# Altium project PowerManagement.PrjPcb
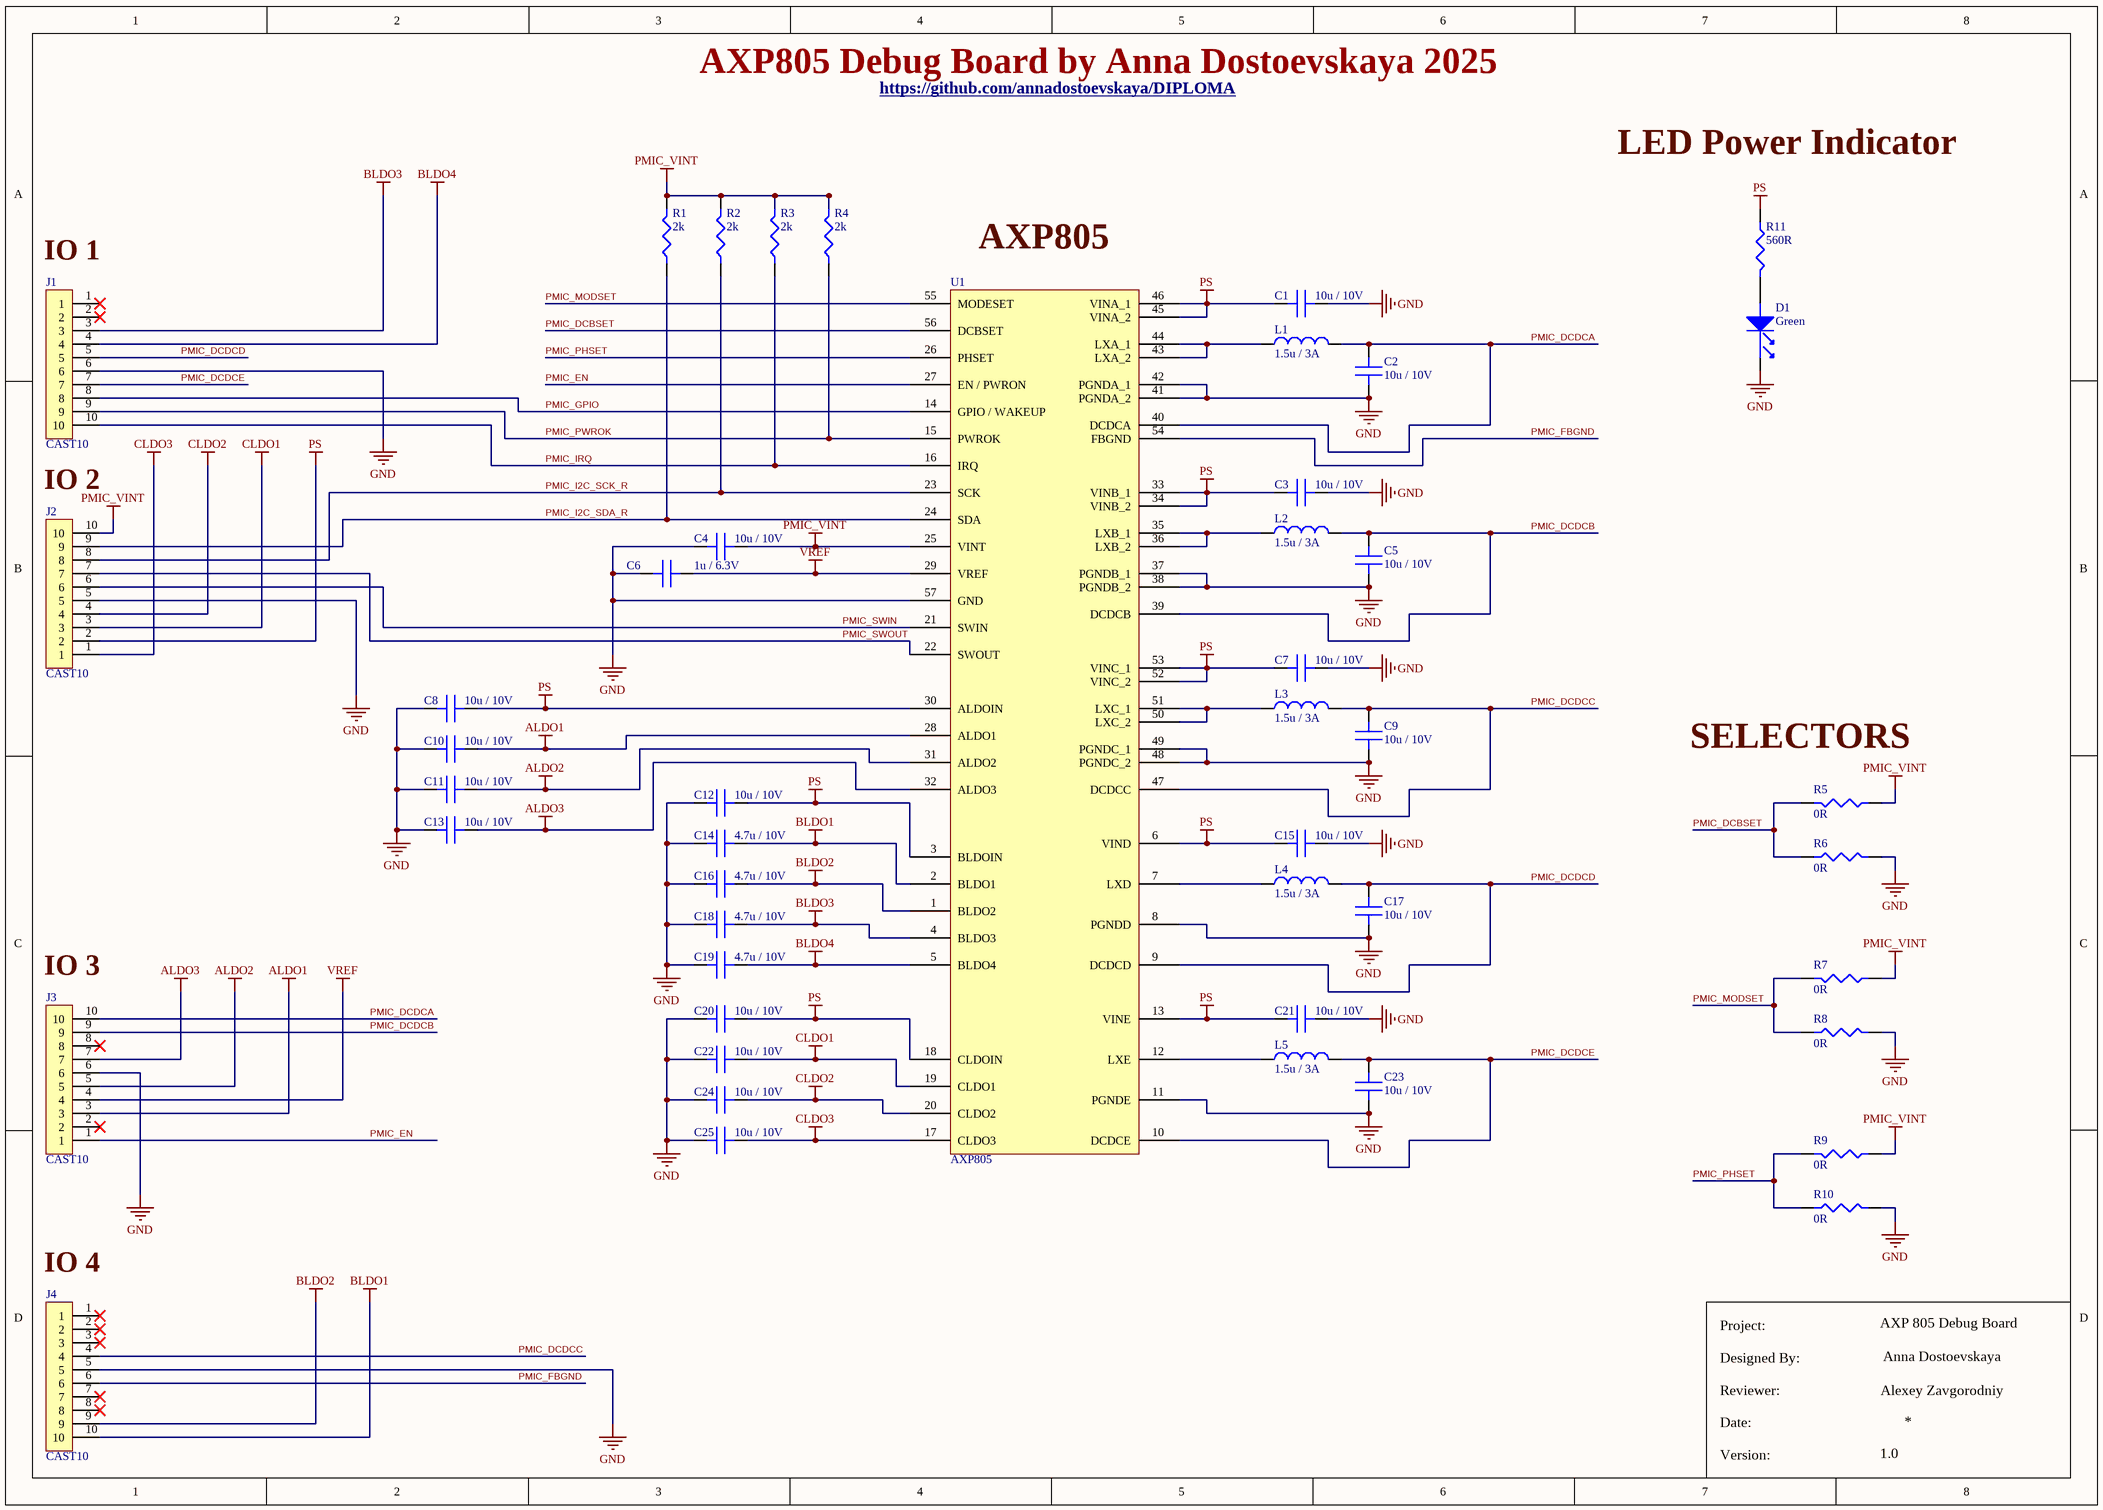
[diagram p0: PowerManagement.SchDoc]
DesignedBy: Anna Dostoevskaya; NotFitted: NF; ProjectTitle: AXP 805 Debug Board; Reviewer: Alexey Zavgorodniy; VersionRevision: 1.0
1 sheet, 47 parts. Net scope: global (net labels, ports and power ports of the same name join across sheets).
Board file: PowerManagement.PcbDoc

## Sheet PowerManagement.SchDoc
size A3; SheetNumber: 1; SheetTotal: 1

### Parts
C1  10u / 10V  [C0603]
C2  10u / 10V  [C0603]
C3  10u / 10V  [C0603]
C4  10u / 10V  [C0603]
C5  10u / 10V  [C0603]
C6  1u / 6.3V  [C0402]
C7  10u / 10V  [C0603]
C8  10u / 10V  [C0603]
C9  10u / 10V  [C0603]
C10  10u / 10V  [C0603]
C11  10u / 10V  [C0603]
C12  10u / 10V  [C0603]
C13  10u / 10V  [C0603]
C14  4.7u / 10V  [C0603]
C15  10u / 10V  [C0603]
C16  4.7u / 10V  [C0603]
C17  10u / 10V  [C0603]
C18  4.7u / 10V  [C0603]
C19  4.7u / 10V  [C0603]
C20  10u / 10V  [C0603]
C21  10u / 10V  [C0603]
C22  10u / 10V  [C0603]
C23  10u / 10V  [C0603]
C24  10u / 10V  [C0603]
C25  10u / 10V  [C0603]
D1  Green  [LED_0603]
J1  CAST10  [CAST10_2.54MM]  (no BOM)
J2  CAST10  [CAST10_2.54MM]  (no BOM)
J3  CAST10  [CAST10_2.54MM]  (no BOM)
J4  CAST10  [CAST10_2.54MM]  (no BOM)
L1  1.5u / 3A  [SPM3015]
L2  1.5u / 3A  [SPM3015]
L3  1.5u / 3A  [SPM3015]
L4  1.5u / 3A  [SPM3015]
L5  1.5u / 3A  [SPM3015]
R1  2k  [R0402]
R2  2k  [R0402]
R3  2k  [R0402]
R4  2k  [R0402]
R5  0R  [R0402]
R6  0R  [R0402]
R7  0R  [R0402]
R8  0R  [R0402]
R9  0R  [R0402]
R10  0R  [R0402]
R11  560R  [R0402]
U1  AXP805  [QFN7x7MM]

### Nets
ALDO1: C10.2 J3.3 U1.28(ALDO1)
ALDO2: C11.2 J3.5 U1.31(ALDO2)
ALDO3: C13.2 J3.7 U1.32(ALDO3)
BLDO1: C14.2 J4.10 U1.2(BLDO1)
BLDO2: C16.2 J4.9 U1.1(BLDO2)
BLDO3: C18.2 J1.3 U1.4(BLDO3)
BLDO4: C19.2 J1.4 U1.5(BLDO4)
CLDO1: C22.2 J2.3 U1.19(CLDO1)
CLDO2: C24.2 J2.4 U1.20(CLDO2)
CLDO3: C25.2 J2.1 U1.17(CLDO3)
GND: C1.2 C2.1 C3.2 C4.1 C5.1 C6.1 C7.2 C8.1 C9.1 C10.1 C11.1 C12.1 C13.1 C14.1 C15.2 C16.1 C17.1 C18.1 C19.1 C20.1 C21.2 C22.1 C23.1 C24.1 C25.1 D1.1(Cathode) J1.6 J2.5 J3.6 J4.5 R6.2 R8.2 R10.2 U1.8(PGNDD) U1.11(PGNDE) U1.37(PGNDB_1) U1.38(PGNDB_2) U1.41(PGNDA_2) U1.42(PGNDA_1) U1.48(PGNDC_2) U1.49(PGNDC_1) U1.57(GND)
PMIC_VINT: C4.2 J2.10 R1.2 R2.2 R3.2 R4.2 R5.1 R7.1 R9.1 U1.25(VINT)
PS: C1.1 C3.1 C7.1 C8.2 C12.2 C15.1 C20.2 C21.1 J2.2 R11.1 U1.3(BLDOIN) U1.6(VIND) U1.13(VINE) U1.18(CLDOIN) U1.30(ALDOIN) U1.33(VINB_1) U1.34(VINB_2) U1.45(VINA_2) U1.46(VINA_1) U1.52(VINC_2) U1.53(VINC_1)
VREF: C6.2 J3.4 U1.29(VREF)
PMIC_DCBSET: R5.2 R6.1 U1.56(DCBSET)
PMIC_DCDCA: C2.2 J3.10 L1.2 U1.40(DCDCA)
PMIC_DCDCB: C5.2 J3.9 L2.2 U1.39(DCDCB)
PMIC_DCDCC: C9.2 J4.4 L3.2 U1.47(DCDCC)
PMIC_DCDCD: C17.2 J1.5 L4.2 U1.9(DCDCD)
PMIC_DCDCE: C23.2 J1.7 L5.2 U1.10(DCDCE)
PMIC_EN: J3.1 U1.27(EN_/_PWRON)
PMIC_FBGND: J4.6 U1.54(FBGND)
PMIC_GPIO: J1.8 U1.14(GPIO_/_WAKEUP)
PMIC_I2C_SCK_R: J2.8 R2.1 U1.23(SCK)
PMIC_I2C_SDA_R: J2.9 R1.1 U1.24(SDA)
PMIC_IRQ: J1.10 R3.1 U1.16(IRQ)
PMIC_MODSET: R7.2 R8.1 U1.55(MODESET)
PMIC_PHSET: R9.2 R10.1 U1.26(PHSET)
PMIC_PWROK: J1.9 R4.1 U1.15(PWROK)
PMIC_SWIN: J2.6 U1.21(SWIN)
PMIC_SWOUT: J2.7 U1.22(SWOUT)
NetD1_2: D1.2(Anode) R11.2
NetL1_1: L1.1 U1.43(LXA_2) U1.44(LXA_1)
NetL2_1: L2.1 U1.35(LXB_1) U1.36(LXB_2)
NetL3_1: L3.1 U1.50(LXC_2) U1.51(LXC_1)
NetL4_1: L4.1 U1.7(LXD)
NetL5_1: L5.1 U1.12(LXE)

Not connected (* = marked no-connect by the designer): J1 1* 2*; J3 2* 8*; J4 1* 2* 3* 7* 8*

### Notes on the sheet
- https://github.com/annadostoevskaya/DIPLOMA
- AXP805 Debug Board by Anna Dostoevskaya 2025
- LED Power Indicator
- (near J1) IO 1
- (near U1) AXP805
- IO 2
- (near R5) SELECTORS
- (near J3) IO 3
- (near J4) IO 4
- Project:
  Designed By:
  Reviewer:
  Date:
  Version:

### Library data of the parts
C1-C5 C7-C13 C15 C17 C20-C25 = C1608X5R1A106K080AC: C Series 0603 10 uF 10 V ±10 % Tolerance X5R SMT Multilayer Ceramic Capacitor; Manufacturer: TDK; Material: 4241ConductorMaterial; Capacitance: 10uF; Tolerance: 10%; Supplier 1: Digikey; Manufacturer Part Number: C1608X5R1A106K080AC; RoHS: Yes; Category: Ceramic Capacitors; Stock 1: 79274; Pricing 1: 1=0.25, 10=0.145, 100=0.0918, 1000=0.06453 (USD); Mount: Surface Mount; Case/Package: 0603; Number of Pins: 2NUMBER; Case Code (Imperial): 0603; Case Code (Metric): 1608; Weight: 7.1E-05oz; Dielectric Material: 4241ConductorMaterial; Min Operating Temperature: -55°C; Max Operating Temperature: 85°C; Dielectric: X5R; Voltage Rating: 10V; Voltage Rating (DC): 10V; Packaging: Tape and Reel; Package Quantity: 1; Termination: SMD/SMT; Voltage: 10V; Series: C; Construction: Flat; Length: 1.6mm; Width: 0.031inch; Height: 0.8mm; Thickness: 0.035inch; Depth: 0.8mm; Reach SVHC Compliant: No; Lead Free: Lead Free; RoHS Compliant: Yes; ComponentLink1URL: https://datasheet.ciiva.com/22694/1796654-22694118.pdf?src-supplier=Element14; ComponentLink1Description: https://datasheet.ciiva.com/22694/1796654-22694118.pdf?src-supplier=Element14; ComponentLink2URL: https://datasheet.ciiva.com/6288/tdkmlcccaprange-6288222.pdf?src-supplier=Digikey; ComponentLink2Description: https://datasheet.ciiva.com/6288/tdkmlcccaprange-6288222.pdf?src-supplier=Digikey; ComponentLink3URL: https://datasheet.ciiva.com/6288/tdkmlcccaprange-6288220.pdf?src-supplier=Digikey; ComponentLink3Description: https://datasheet.ciiva.com/6288/tdkmlcccaprange-6288220.pdf?src-supplier=Digikey; ComponentLink4URL: https://datasheet.ciiva.com/16449/mlcc-commercial-general-en-16449573.pdf?src-supplier=Future+Electronics; ComponentLink4Description: https://datasheet.ciiva.com/16449/mlcc-commercial-general-en-16449573.pdf?src-supplier=Future+Electronics; ComponentLink5URL: https://datasheet.ciiva.com/48671/e412-c-48671301.pdf?src-supplier=Avnet; ComponentLink5Description: https://datasheet.ciiva.com/48671/e412-c-48671301.pdf?src-supplier=Avnet; ComponentLink6URL: https://datasheet.ciiva.com/23802/1796654-23802763.pdf?src-supplier=Newark; ComponentLink6Description: https://datasheet.ciiva.com/23802/1796654-23802763.pdf?src-supplier=Newark; ComponentLink7URL: https://datasheet.ciiva.com/7975/1796654-7975065.pdf?src-supplier=Element14; ComponentLink7Description: https://datasheet.ciiva.com/7975/1796654-7975065.pdf?src-supplier=Element14; ComponentLink8URL: https://datasheet.ciiva.com/28577/1744655-28577071.pdf?src-supplier=Element14; ComponentLink8Description: https://datasheet.ciiva.com/28577/1744655-28577071.pdf?src-supplier=Element14; ComponentLink9URL: https://datasheet.ciiva.com/6288/tdkmlcccaprange-6288223.pdf?src-supplier=Digikey; ComponentLink9Description: https://datasheet.ciiva.com/6288/tdkmlcccaprange-6288223.pdf?src-supplier=Digikey; ComponentLink10URL: https://datasheet.ciiva.com/28577/mlcc-commercial-general-en-28577085.pdf?src-supplier=Element14; ComponentLink10Description: https://datasheet.ciiva.com/28577/mlcc-commercial-general-en-28577085.pdf?src-supplier=Element14; Supplier Part Number 1: 445-C1608X5R1A106K080ACCT-ND
C6 = CC0402KRX5R5BB105: Multilayer Ceramic Capacitor, 1 uF, 100 V, ï¿½ 10%, X7R, 0402 [1005 Metric]; Manufacturer: Yageo; Material: 4241ConductorMaterial; Capacitance: 1uF; Dielectric: X5R; Temperature Coefficient: 30ppm/°C; Supplier 1: Digikey; Manufacturer Part Number: CC0402KRX5R5BB105; RoHS: Yes; Category: Ceramic Capacitors; Stock 1: 21109651; Pricing 1: 1=0.1, 10=0.054, 100=0.0318, 1000=0.02066, 2500=0.01646, 5000=0.01625 (USD); Mount: Surface Mount; Case/Package: 0402; Number of Pins: 2; Case Code (Metric): 1005; Case Code (Imperial): 0402; Dielectric Material: 4241ConductorMaterial; Min Operating Temperature: -55°C; Max Operating Temperature: 85°C; Tolerance: 10%; Voltage Rating: 6.3V; Voltage Rating (DC): 6.3V; Packaging: Tape and Reel; Termination: SMD/SMT; Series: CC; Voltage Rating (AC): 6.3V; Length: 1mm; Width: 0.5mm; Height: 0.5mm; Depth: 0.5mm; Radiation Hardening: No; Reach SVHC Compliant: No; RoHS Compliant: Yes; Lead Free: 5697LeadFree; Halogen Free: 5694HalogenFree; ComponentLink1URL: https://datasheet.ciiva.com/5789/70765-5789520.pdf?src-supplier=Farnell; ComponentLink1Description: https://datasheet.ciiva.com/5789/70765-5789520.pdf?src-supplier=Farnell; ComponentLink2URL: https://datasheet.ciiva.com/8033/70765-8033646.pdf?src-supplier=Element14; ComponentLink2Description: https://datasheet.ciiva.com/8033/70765-8033646.pdf?src-supplier=Element14; ComponentLink3URL: https://datasheet.ciiva.com/176/mlccorderingcode-176610.pdf?src-supplier=Digikey; ComponentLink3Description: https://datasheet.ciiva.com/176/mlccorderingcode-176610.pdf?src-supplier=Digikey; ComponentLink4URL: https://datasheet.ciiva.com/176/mlccorderingcode-176609.pdf?src-supplier=Digikey; ComponentLink4Description: https://datasheet.ciiva.com/176/mlccorderingcode-176609.pdf?src-supplier=Digikey; ComponentLink5URL: https://datasheet.ciiva.com/176/mlccorderingcode-176611.pdf?src-supplier=Digikey; ComponentLink5Description: https://datasheet.ciiva.com/176/mlccorderingcode-176611.pdf?src-supplier=Digikey; ComponentLink6URL: https://datasheet.ciiva.com/8033/1525783-8033644.pdf?src-supplier=Element14; ComponentLink6Description: https://datasheet.ciiva.com/8033/1525783-8033644.pdf?src-supplier=Element14; ComponentLink7URL: https://datasheet.ciiva.com/28450/1359354-28450285.pdf?src-supplier=Element14; ComponentLink7Description: https://datasheet.ciiva.com/28450/1359354-28450285.pdf?src-supplier=Element14; ComponentLink8URL: https://datasheet.ciiva.com/8033/1525783-8033643.pdf?src-supplier=Element14; ComponentLink8Description: https://datasheet.ciiva.com/8033/1525783-8033643.pdf?src-supplier=Element14; ComponentLink9URL: https://datasheet.ciiva.com/11464/upy-gphc-x5r-4v-to-50v-12-11464863.pdf?src-supplier=Avnet; ComponentLink9Description: https://datasheet.ciiva.com/11464/upy-gphc-x5r-4v-to-50v-12-11464863.pdf?src-supplier=Avnet; Supplier Part Number 1: 311-1438-1-ND; ComponentLink10Description: AliExpress; ComponentLink10URL: https://aliexpress.ru/item/1005001948033366.html
C14 C16 C18 C19 = C1608X5R1A475K080AE: C Series 0603 4.7 uF 10 V ±10 %Tolerance X5R SMT Multilayer Ceramic Capacitor; Manufacturer: TDK; Supplier 1: Digikey; Manufacturer Part Number: C1608X5R1A475K080AE; RoHS: Yes; Category: Ceramic Capacitors; Stock 1: 16947; Pricing 1: 1=0.26, 10=0.15, 100=0.0952, 1000=0.06716 (USD); ComponentLink1URL: https://product.tdk.com/info/en/catalog/datasheets/mlcc_commercial_soft_en.pdf?src-supplier=Digikey; ComponentLink1Description: https://product.tdk.com/info/en/catalog/datasheets/mlcc_commercial_soft_en.pdf?src-supplier=Digikey; ComponentLink2URL: https://product.tdk.com/info/en/catalog/datasheets/mlcc_commercial_soft_en.pdf?ref_disty=digikey&src-supplier=Digikey; ComponentLink2Description: https://product.tdk.com/info/en/catalog/datasheets/mlcc_commercial_soft_en.pdf?ref_disty=digikey&src-supplier=Digikey; ComponentLink3URL: https://product.tdk.com/info/en/catalog/spec/mlccspec_commercial_soft_en.pdf?src-supplier=Digikey; ComponentLink3Description: https://product.tdk.com/info/en/catalog/spec/mlccspec_commercial_soft_en.pdf?src-supplier=Digikey; ComponentLink4URL: https://datasheet.octopart.com/C1608X5R1A475K080AE-TDK-datasheet-60278151.pdf?src-supplier=Future+Electronics; ComponentLink4Description: https://datasheet.octopart.com/C1608X5R1A475K080AE-TDK-datasheet-60278151.pdf?src-supplier=Future+Electronics; ComponentLink5URL: https://datasheet.octopart.com/C1608X5R1A475K080AE-TDK-datasheet-159617022.pdf?src-supplier=TME; ComponentLink5Description: https://datasheet.octopart.com/C1608X5R1A475K080AE-TDK-datasheet-159617022.pdf?src-supplier=TME; Supplier Part Number 1: 445-175224-1-ND
D1 = KG EELP41.22-PHRH-35-A8J8-20-R18: Led Green Diffused 0603 SMD; Manufacturer: Osram Opto; Supplier 1: Mouser; Manufacturer Part Number: KG EELP41.22-PHRH-35-A8J8-20-R18; RoHS: No; Category: Optoelectronics; Stock 1: 7148; Pricing 1: 1=0.25, 10=0.138, 50=0.138, 100=0.064, 1000=0.046, 10000=0.035 (USD); Supplier Part Number 1: 720-P4122PHRH35A8J82
J1-J4 = CAST10_2.54MM: 10x Castellated Plated Through-Holes, 2.54mm Pitch.
L1-L5 = SPM3015T-1R5M-LR: Inductor Power Shielded Wirewound 1.5uH 20% 100KHz Metal 3.3A 0.0624Ohm DCR T/R; Manufacturer: TDK; Saturation Current: 4.5A; DC Resistance (DCR): 62.4mR; Supplier 1: Digikey; Manufacturer Part Number: SPM3015T-1R5M-LR; RoHS: Yes; Category: Fixed Inductors; Pricing 1: 1=1, 10=0.82, 100=0.674, 1000=0.55442 (USD); Mount: Surface Mount; Case/Package: Nonstandard; Core Material: Metal; Min Operating Temperature: -40°C; Max Operating Temperature: 125°C; Packaging: Cut Tape; Inductance: 1.5uH; Shielding: Shielded; Test Frequency: 100kHz; Tolerance: 20%; Series: SPM-LR; Current Rating: 3.3A; RMS Current (Irms): 3.3A; Inductance Tolerance: 20%; Length: 0.126inch; Width: 0.118inch; Height - Seated (Max): 0.047inch; RoHS Compliant: Yes; Reach SVHC Compliant: No; ComponentLink1URL: https://product.tdk.com/info/en/catalog/datasheets/inductor_commercial_power_spm3015-lr_en.pdf?src-supplier=Digikey; ComponentLink1Description: https://product.tdk.com/info/en/catalog/datasheets/inductor_commercial_power_spm3015-lr_en.pdf?src-supplier=Digikey; ComponentLink2URL: http://www.farnell.com/datasheets/2053094.pdf?src-supplier=Element14; ComponentLink2Description: http://www.farnell.com/datasheets/2053094.pdf?src-supplier=Element14; Supplier Part Number 1: 445-174448-1-ND
R1-R4 = RC0402BR-072KL: General Purpose Chip Resistor Thick Film 0402 2kOhm 0.1% Paper T/R; Manufacturer: Yageo; Supplier 1: Digikey; Manufacturer Part Number: RC0402BR-072KL; RoHS: Yes; Category: Chip SMD Resistors; Stock 1: 18357; Pricing 1: 1=0.23, 10=0.127, 100=0.0898, 1000=0.06936, 2500=0.05763, 5000=0.04998 (USD); RoHS Compliant: Yes; Supplier Part Number 1: 13-RC0402BR-072KLCT-ND
R5-R10 = PA0402-R-070RL: Zero Ohm Resistor, Jumper, 0402 [1005 Metric], Metal Film, 63 mW, 11 A, Surface Mount; Manufacturer: Yageo; Supplier 1: Digikey; Manufacturer Part Number: PA0402-R-070RL; RoHS: Yes; Category: Chip SMD Resistors; Stock 1: 19936; Pricing 1: 1=0.9, 10=0.582, 25=0.4972, 50=0.4436, 100=0.3982, 250=0.3484, 500=0.31718, 1000=0.29067, 5000=0.24347 (USD); Height: 350um; ComponentLink1URL: http://www.yageo.com/NewPortal/_en/search/productDocs.jsp?YageoPartNumber=PA0402-R-070RL&src-supplier=Digikey; ComponentLink1Description: http://www.yageo.com/NewPortal/_en/search/productDocs.jsp?YageoPartNumber=PA0402-R-070RL&src-supplier=Digikey; ComponentLink2URL: https://datasheet.octopart.com/PA0402-R-070RL-Yageo-datasheet-137700557.pdf?src-supplier=Future+Electronics; ComponentLink2Description: https://datasheet.octopart.com/PA0402-R-070RL-Yageo-datasheet-137700557.pdf?src-supplier=Future+Electronics; Supplier Part Number 1: YAG5756CT-ND
R11 = RC0402FR-13560RL: SMD Chip Resistor, 560 Ohm, ± 1%, 63 mW, 0402 [1005 Metric], Thick Film, General Purpose; Manufacturer: Yageo; Supplier 1: Digikey; Manufacturer Part Number: RC0402FR-13560RL; RoHS: Yes; Category: Chip SMD Resistors; Stock 1: 81328; Pricing 1: 1=0.1, 10=0.007, 100=0.0051, 1000=0.00408, 2500=0.00306, 10000=0.00286 (USD); Lead Free: 5697LeadFree; ComponentLink1URL: https://datasheet.ciiva.com/8885/pyu-rc0402-51-rohs-l-6-8885291.pdf?src-supplier=Avnet; ComponentLink1Description: https://datasheet.ciiva.com/8885/pyu-rc0402-51-rohs-l-6-8885291.pdf?src-supplier=Avnet; Supplier Part Number 1: 13-RC0402FR-13560RLCT-ND
U1 = AXP805: PMIC for Multi-Core High-Performance System; Manufacturer: X-Powers; Max Junction Temperature (Tj): 125 °C; Max Supply Voltage: 5.5 V; Min Supply Voltage: 3 V; Number of Outputs: 9; Ambient Temperature Range High: 85 °C; Max Operating Temperature: 125 °C; Height: 800 µm; Manufacturer Part Number: AXP805; Category: Power Management (PMIC); RoHS: *; ComponentLink1Description: datasheet; ComponentLink1URL: https://linux-sunxi.org/images/b/bc/AXP805_Datasheet_V1.0_en.pdf; Supplier 1: AliExpress; Supplier Part Number 1: 1005008574347512; Stock 1: *; Pricing 1: *; ComponentLink2Description: Supplier Link 1; ComponentLink2URL: https://aliexpress.ru/item/1005008574347512.html?sku_id=12000045786397552; Supplier Note 1: For prototype